# Altium schematic sheet control_unit.schdoc
size 187 x 125 mm
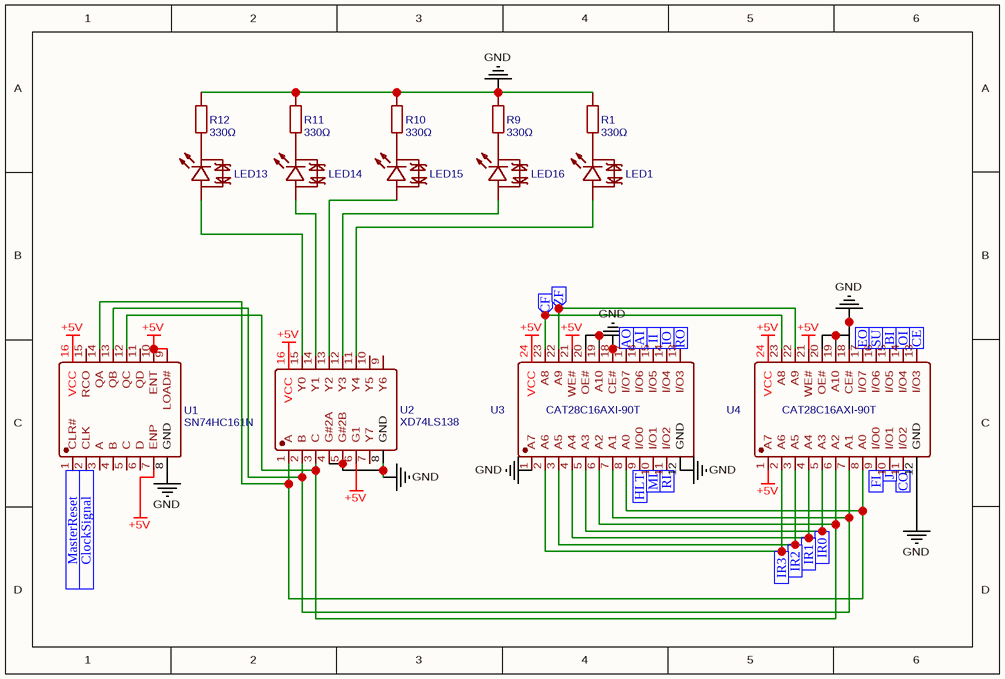
[diagram p0: control_unit.schdoc]

## Parts
LED1  204-15UTC/S400-X9-L  [LED-TH_BD3.0-P2.54-FD]  (value not drawn)
LED13  204-15UTC/S400-X9-L  [LED-TH_BD3.0-P2.54-FD]  (value not drawn)
LED14  204-15UTC/S400-X9-L  [LED-TH_BD3.0-P2.54-FD]  (value not drawn)
LED15  204-15UTC/S400-X9-L  [LED-TH_BD3.0-P2.54-FD]  (value not drawn)
LED16  204-15UTC/S400-X9-L  [LED-TH_BD3.0-P2.54-FD]  (value not drawn)
R1  330Ω  [RES-TH_BD3.3-L9.0-P13.00-D0.6]
R9  330Ω  [RES-TH_BD3.3-L9.0-P13.00-D0.6]
R10  330Ω  [RES-TH_BD3.3-L9.0-P13.00-D0.6]
R11  330Ω  [RES-TH_BD3.3-L9.0-P13.00-D0.6]
R12  330Ω  [RES-TH_BD3.3-L9.0-P13.00-D0.6]
U1  SN74HC161N  [PDIP-16_L19.3-W6.4-P2.54-LS7.9-BL]
U2  XD74LS138  [DIP-16_L19.8-W6.5-P2.54-LS7.6-BL]
U3  CAT28C16AXI-90T  [SOIC-24_L15.0-W5.3-P1.27-LS7.8-BL]
U4  CAT28C16AXI-90T  [SOIC-24_L15.0-W5.3-P1.27-LS7.8-BL]

## Ports
AI (in), AO (in), BI (in), CE (in), CF (in), ClockSignal (in), CO (in), EO (in), FI (in), HLT (in), II (in), IO (in), IR0 (in), IR1 (in), IR2 (in), IR3 (in), J (in), MasterReset (in), MI (in), OI (in), RI (in), RO (in), SU (in), ZF (in)

## Nets
+5V: U1.7(ENP) U1.9(LOAD#) U1.10(ENT) U1.16(VCC) U2.6(G1) U2.16(VCC) U3.21(WE#) U3.24(VCC) U4.1(A7) U4.21(WE#) U4.24(VCC)
GND: R1.2 R9.2 R10.2 R11.2 R12.2 U1.8(GND) U2.4(G#2A) U2.5(G#2B) U2.8(GND) U3.1(A7) U3.12(GND) U3.18(CE#) U3.19(A10) U3.20(OE#) U4.12(GND) U4.18(CE#) U4.19(A10) U4.20(OE#)
AI: U3.16(I/O6) ; port AI
AO: U3.17(I/O7) ; port AO
BI: U4.15(I/O5) ; port BI
CE: U4.13(I/O3) ; port CE
CF: U3.23(A8) U4.23(A8) ; port CF
ClockSignal: U1.2(CLK) ; port ClockSignal
CO: U4.11(I/O2) ; port CO
EO: U4.17(I/O7) ; port EO
FI: U4.9(I/O0) ; port FI
HLT: U3.9(I/O0) ; port HLT
II: U3.15(I/O5) ; port II
IO: U3.14(I/O4) ; port IO
IR0: U3.5(A3) U4.5(A3) ; port IR0
IR1: U3.4(A4) U4.4(A4) ; port IR1
IR2: U3.3(A5) U4.3(A5) ; port IR2
IR3: U3.2(A6) U4.2(A6) ; port IR3
J: U4.10(I/O1) ; port J
MasterReset: U1.1(CLR#) ; port MasterReset
MI: U3.10(I/O1) ; port MI
OI: U4.14(I/O4) ; port OI
RI: U3.11(I/O2) ; port RI
RO: U3.13(I/O3) ; port RO
SU: U4.16(I/O6) ; port SU
ZF: U3.22(A9) U4.22(A9) ; port ZF
NetLED1_1: LED1.1(A) U2.11(Y4)
NetLED1_2: LED1.2(C) R1.1
NetLED13_1: LED13.1(A) U2.15(Y0)
NetLED13_2: LED13.2(C) R12.1
NetLED14_1: LED14.1(A) U2.14(Y1)
NetLED14_2: LED14.2(C) R11.1
NetLED15_1: LED15.1(A) U2.13(Y2)
NetLED15_2: LED15.2(C) R10.1
NetLED16_1: LED16.1(A) U2.12(Y3)
NetLED16_2: LED16.2(C) R9.1
NetU1_12: U1.12(QC) U2.3(C) U3.6(A2) U4.6(A2)
NetU1_13: U1.13(QB) U2.2(B) U3.7(A1) U4.7(A1)
NetU1_14: U1.14(QA) U2.1(A) U3.8(A0) U4.8(A0)

Not connected (* = marked no-connect by the designer): U1 3(A) 4(B) 5(C) 6(D) 11(QD) 15(RCO); U2 7(Y7) 9(Y6) 10(Y5)

## Library data of the parts
LED1 LED13-LED16 = 204-15UTC/S400-X9-L: Manufacturer: EVERLIGHT(亿光); Contributor: LCSC; Supplier: LCSC; Supplier Part: C282138; Manufacturer Part: 204-15UTC/S400-X9-L; JLCPCB Part Class: Extended Part; spicePre: L; spiceSymbolName: 204-15UTC/S400-X9-L
R1 R9-R12 = 330Ω: Manufacturer: CCO(千志电子); Manufacturer Part: MF1/2W-0.1Ω±1% T; nameAlias: Value; Contributor: LCSC; Supplier: LCSC; Supplier Part: C119393; JLCPCB Part Class: Extended Part; spicePre: R; spiceSymbolName: MF1/2W-0.1Ω±1% T52
U1 = SN74HC161N: Manufacturer: TI(德州仪器); Contributor: lcsc; Supplier: LCSC; Supplier Part: C273647; Manufacturer Part: SN74HC161N; JLCPCB Part Class: Extended Part; spicePre: U; spiceSymbolName: SN74HC161N
U2 = XD74LS138: Manufacturer: XINLUDA(信路达); Contributor: LCSC; Supplier: LCSC; Supplier Part: C513527; Manufacturer Part: XD74LS138; JLCPCB Part Class: Extended Part; spicePre: U; spiceSymbolName: XD74LS138
U3 U4 = CAT28C16AXI-90T: Manufacturer: onsemi(安森美); Contributor: lcsc; Supplier: LCSC; Supplier Part: C19304548; Manufacturer Part: CAT28C16AXI-90T; JLCPCB Part Class: Extended Part; spicePre: U; spiceSymbolName: CAT28C16AXI-90T